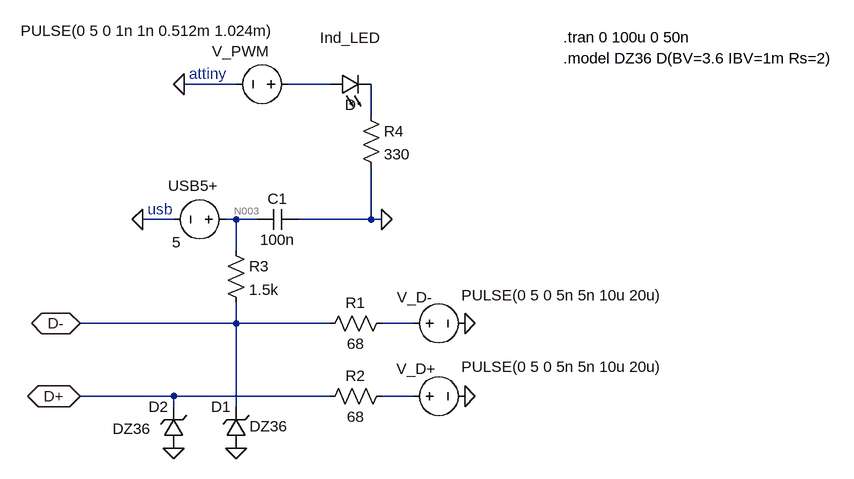
[diagram p0: schematic LT_Voltage_clamp.asc]
LT_Voltage_clamp.asc, the LTspice schematic file:
Version 4.1
SHEET 1 956 680
WIRE 0 -224 -80 -224
WIRE 144 -224 80 -224
WIRE 208 -176 208 -224
WIRE -96 -16 -144 -16
WIRE 0 -16 -16 -16
WIRE 32 -16 0 -16
WIRE 208 -16 208 -96
WIRE 208 -16 96 -16
WIRE 224 -16 208 -16
WIRE 0 32 0 -16
WIRE 0 144 0 112
WIRE 0 144 -240 144
WIRE 144 144 0 144
WIRE 272 144 224 144
WIRE -96 256 -240 256
WIRE 144 256 -96 256
WIRE 272 256 224 256
WIRE -96 272 -96 256
WIRE 0 272 0 144
FLAG 224 -16 0
FLAG -80 -224 0
FLAG -144 -16 0
FLAG 0 336 0
FLAG -96 336 0
FLAG -240 144 D-
IOPIN -240 144 BiDir
FLAG -240 256 D+
IOPIN -240 256 BiDir
FLAG 352 144 0
FLAG 352 256 0
SYMBOL res 240 128 R90
WINDOW 0 0 56 VBottom 2
WINDOW 3 32 56 VTop 2
SYMATTR InstName R1
SYMATTR Value 68
SYMBOL res 240 240 R90
WINDOW 0 0 56 VBottom 2
WINDOW 3 32 56 VTop 2
SYMATTR InstName R2
SYMATTR Value 68
SYMBOL res -16 16 R0
SYMATTR InstName R3
SYMATTR Value 1.5k
SYMBOL res 192 -192 R0
SYMATTR InstName R4
SYMATTR Value 330
SYMBOL cap 32 0 R270
WINDOW 0 32 32 VTop 2
WINDOW 3 0 32 VBottom 2
SYMATTR InstName C1
SYMATTR Value 100n
SYMBOL zener 16 336 R180
WINDOW 0 24 64 Left 2
WINDOW 3 -64 34 Left 2
SYMATTR InstName D1
SYMATTR Value DZ36
SYMBOL zener -80 336 R180
WINDOW 0 24 64 Left 2
WINDOW 3 51 30 Left 2
SYMATTR InstName D2
SYMATTR Value DZ36
SYMBOL LED 144 -208 R270
WINDOW 0 72 32 VTop 2
WINDOW 3 0 32 VBottom 2
SYMATTR InstName Ind_LED
SYMBOL voltage 96 -224 R90
WINDOW 0 -51 45 VRight 2
WINDOW 3 -82 36 VRight 2
WINDOW 123 0 0 Left 0
WINDOW 39 0 0 Left 0
SYMATTR InstName V_PWM
SYMATTR Value PULSE(0 5 0 1n 1n 0.512m 1.024m)
SYMBOL voltage 0 -16 R90
WINDOW 0 -52 28 VRight 2
WINDOW 3 35 85 VRight 2
WINDOW 123 0 0 Left 0
WINDOW 39 0 0 Left 0
SYMATTR InstName USB5+
SYMATTR Value 5
SYMBOL voltage 256 144 R270
WINDOW 0 25 19 VTop 2
WINDOW 3 59 246 VBottom 2
WINDOW 123 0 0 Left 0
WINDOW 39 0 0 Left 0
SYMATTR InstName V_D-
SYMATTR Value PULSE(0 5 0 5n 5n 10u 20u)
SYMBOL voltage 256 256 R270
WINDOW 0 27 21 VTop 2
WINDOW 3 61 246 VBottom 2
WINDOW 123 0 0 Left 0
WINDOW 39 0 0 Left 0
SYMATTR InstName V_D+
SYMATTR Value PULSE(0 5 0 5n 5n 10u 20u)
TEXT -136 -32 Left 2 ;usb
TEXT -72 -240 Left 2 ;attiny
TEXT 504 -296 Left 2 !.tran 0 100u 0 50n
TEXT 504 -264 Left 2 !.model DZ36 D(BV=3.6 IBV=1m Rs=2)

The netlist it stands for:
* LT_Voltage_clamp.asc
R1 N004 D- 68
R2 N005 D+ 68
R3 N003 D- 1.5k
R4 N002 0 330
C1 N003 0 100n
D1 0 D- DZ36
D2 0 D+ DZ36
D§Ind_LED N001 N002 D
V_PWM N001 0 PULSE(0 5 0 1n 1n 0.512m 1.024m)
V§USB5+ N003 0 5
V_D- N004 0 PULSE(0 5 0 5n 5n 10u 20u)
V_D+ N005 0 PULSE(0 5 0 5n 5n 10u 20u)
.model D D
.lib standard.dio
* usb
* attiny
.tran 0 100u 0 50n
.model DZ36 D(BV=3.6 IBV=1m Rs=2)
.backanno
.end

* Results of the author's LTspice run, read from the files saved beside the schematic
* Operating Point, zero values left out:
*   V(d-) = 216.8 mV
*   V(n003) = 5 V
*   I(R1) = -3.189 mA
*   I(R3) = 3.189 mA
*   I(USB5+) = -3.189 mA
*   I(V_D-) = 3.189 mA
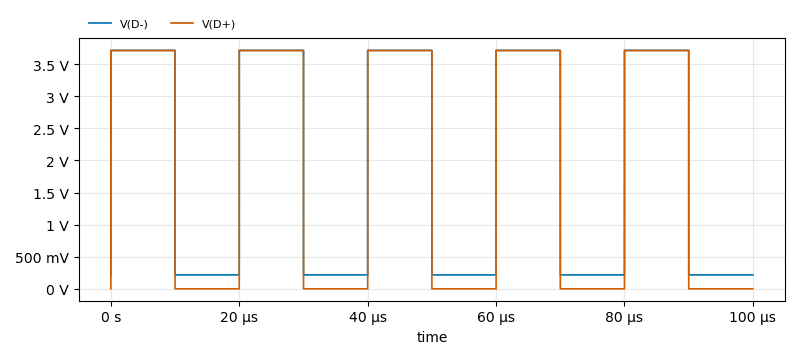
[diagram p1: Transient Analysis of LT_Voltage_clamp.asc, plotted from the saved traces]
* Transient Analysis, 1 run:
*   V(D-): min 216.8 mV, max 3.717 V, average 1.968 V, rms 2.633 V, last 216.8 mV
*   V(D+): min 0 V, max 3.714 V, average 1.858 V, rms 2.627 V, last 0 V